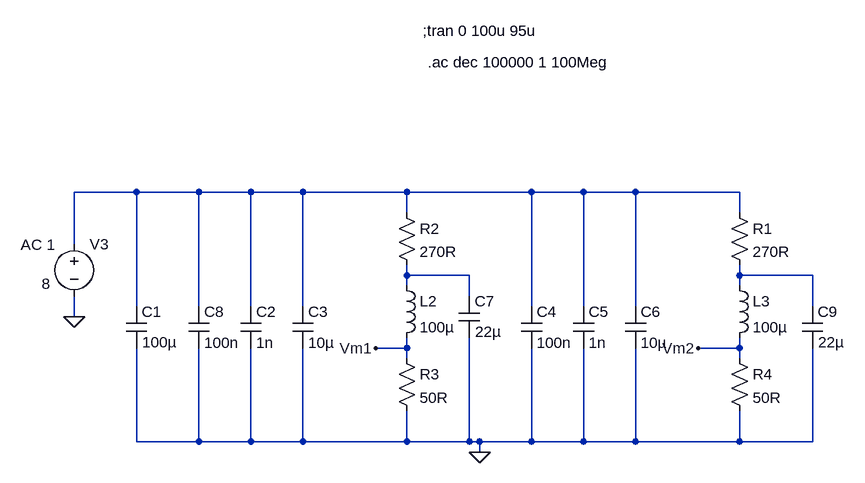
[diagram p0: schematic MAR Decoupling Test.asc]
MAR Decoupling Test.asc, the LTspice schematic file:
Version 4
SHEET 1 1176 1300
WIRE -608 208 -704 208
WIRE -512 208 -608 208
WIRE -432 208 -512 208
WIRE -352 208 -432 208
WIRE -192 208 -352 208
WIRE 0 208 -192 208
WIRE 80 208 0 208
WIRE 160 208 80 208
WIRE 320 208 160 208
WIRE -192 240 -192 208
WIRE 320 240 320 208
WIRE -704 288 -704 208
WIRE -192 336 -192 320
WIRE -96 336 -192 336
WIRE 320 336 320 320
WIRE 432 336 320 336
WIRE -192 352 -192 336
WIRE 320 352 320 336
WIRE -96 368 -96 336
WIRE -608 384 -608 208
WIRE -512 384 -512 208
WIRE -432 384 -432 208
WIRE -352 384 -352 208
WIRE 0 384 0 208
WIRE 80 384 80 208
WIRE 160 384 160 208
WIRE 432 384 432 336
WIRE -704 400 -704 368
WIRE -192 448 -192 432
WIRE -192 448 -240 448
WIRE 320 448 320 432
WIRE 320 448 256 448
WIRE -192 464 -192 448
WIRE 320 464 320 448
WIRE -608 592 -608 448
WIRE -512 592 -512 448
WIRE -512 592 -608 592
WIRE -432 592 -432 448
WIRE -432 592 -512 592
WIRE -352 592 -352 448
WIRE -352 592 -432 592
WIRE -192 592 -192 544
WIRE -192 592 -352 592
WIRE -96 592 -96 432
WIRE -96 592 -192 592
WIRE -80 592 -96 592
WIRE 0 592 0 448
WIRE 0 592 -80 592
WIRE 80 592 80 448
WIRE 80 592 0 592
WIRE 160 592 160 448
WIRE 160 592 80 592
WIRE 320 592 320 544
WIRE 320 592 160 592
WIRE 432 592 432 448
WIRE 432 592 320 592
WIRE -80 608 -80 592
FLAG -704 400 0
FLAG -80 608 0
FLAG -240 448 Vm1
FLAG 256 448 Vm2
SYMBOL voltage -704 272 R0
WINDOW 3 -50 77 Left 2
WINDOW 123 -82 17 Left 2
WINDOW 39 0 0 Left 2
SYMATTR Value 8
SYMATTR Value2 AC 1
SYMATTR InstName V3
SYMBOL cap -528 384 R0
SYMATTR InstName C8
SYMATTR Value 100n
SYMBOL cap -624 384 R0
WINDOW 3 25 55 Left 2
SYMATTR Value 100µ
SYMATTR InstName C1
SYMBOL cap -448 384 R0
SYMATTR InstName C2
SYMATTR Value 1n
SYMBOL res -208 224 R0
SYMATTR InstName R2
SYMATTR Value 270R
SYMBOL ind -208 336 R0
SYMATTR InstName L2
SYMATTR Value 100µ
SYMBOL res -208 448 R0
SYMATTR InstName R3
SYMATTR Value 50R
SYMBOL cap -368 384 R0
SYMATTR InstName C3
SYMATTR Value 10µ
SYMBOL cap -16 384 R0
SYMATTR InstName C4
SYMATTR Value 100n
SYMBOL cap 64 384 R0
SYMATTR InstName C5
SYMATTR Value 1n
SYMBOL res 304 224 R0
SYMATTR InstName R1
SYMATTR Value 270R
SYMBOL ind 304 336 R0
SYMATTR InstName L3
SYMATTR Value 100µ
SYMBOL res 304 448 R0
SYMATTR InstName R4
SYMATTR Value 50R
SYMBOL cap 144 384 R0
SYMATTR InstName C6
SYMATTR Value 10µ
SYMBOL cap -112 368 R0
WINDOW 3 25 55 Left 2
SYMATTR Value 22µ
SYMATTR InstName C7
SYMBOL cap 416 384 R0
WINDOW 3 25 55 Left 2
SYMATTR Value 22µ
SYMATTR InstName C9
TEXT -168 -40 Left 2 !;tran 0 100u 95u
TEXT -160 8 Left 2 !.ac dec 100000 1 100Meg

The netlist it stands for:
* MAR Decoupling Test.asc
V3 N001 0 8 AC 1
C8 N001 0 100n
C1 N001 0 100µ
C2 N001 0 1n
R2 N001 N002 270R
L2 N002 Vm1 100µ
R3 Vm1 0 50R
C3 N001 0 10µ
C4 N001 0 100n
C5 N001 0 1n
R1 N001 N003 270R
L3 N003 Vm2 100µ
R4 Vm2 0 50R
C6 N001 0 10µ
C7 N002 0 22µ
C9 N003 0 22µ
;tran 0 100u 95u
.ac dec 100000 1 100Meg
.backanno
.end